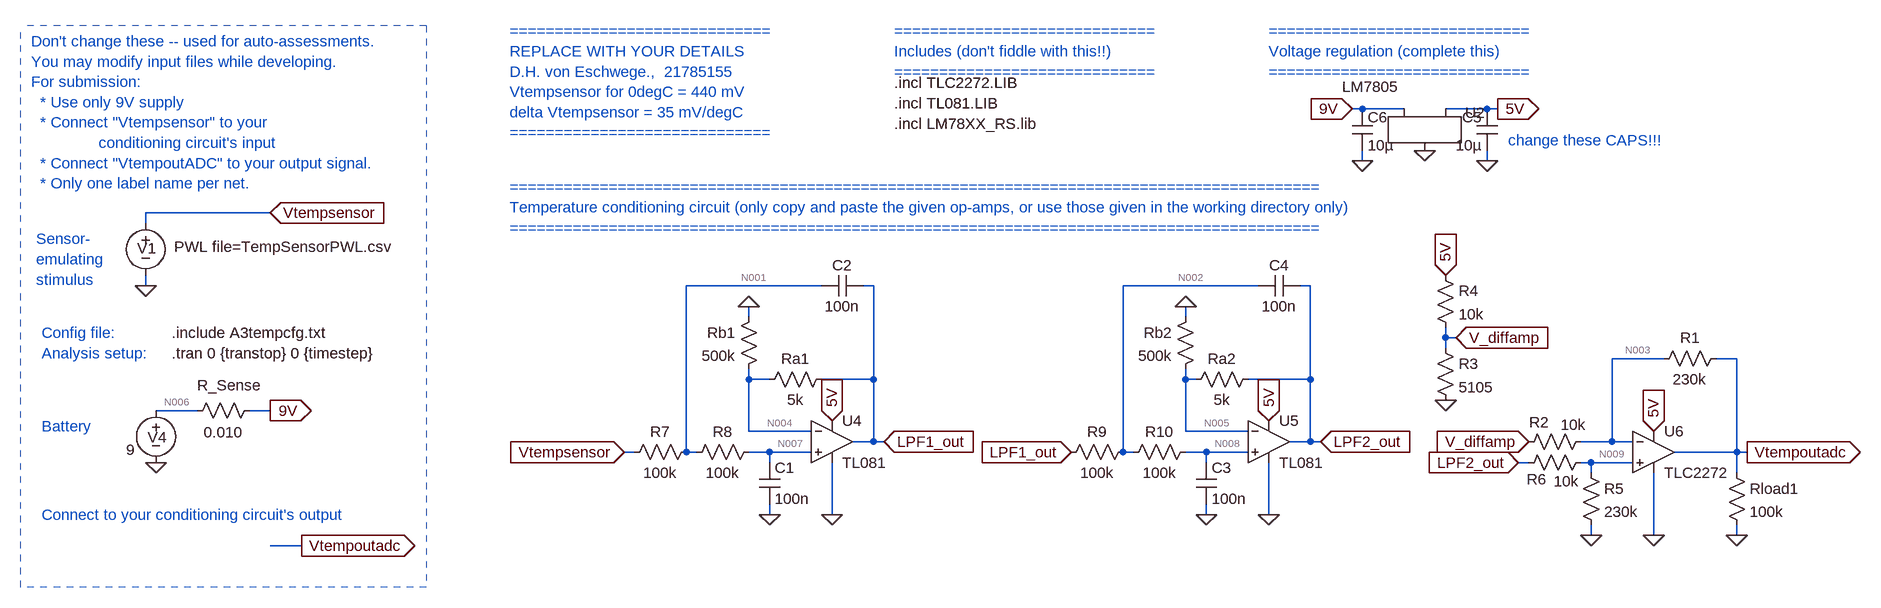
[diagram p0: schematic E344_A3_temp.asc]
E344_A3_temp.asc, the LTspice schematic file:
Version 4
SHEET 1 1824 680
WIRE -240 -1280 -256 -1280
WIRE -176 -1280 -240 -1280
WIRE -48 -1280 -112 -1280
WIRE -32 -1280 -48 -1280
WIRE -240 -1200 -240 -1216
WIRE -48 -1200 -48 -1216
WIRE -1920 -1120 -2112 -1120
WIRE -2112 -1104 -2112 -1120
WIRE -2112 -1008 -2112 -1024
WIRE -1072 -1008 -1280 -1008
WIRE -992 -1008 -1008 -1008
WIRE -400 -1008 -608 -1008
WIRE -320 -1008 -336 -1008
WIRE -1184 -960 -1184 -976
WIRE -512 -960 -512 -976
WIRE -112 -928 -112 -944
WIRE -96 -928 -112 -928
WIRE -112 -912 -112 -928
WIRE 224 -896 144 -896
WIRE 336 -896 304 -896
WIRE -1184 -864 -1184 -880
WIRE -1152 -864 -1184 -864
WIRE -992 -864 -992 -1008
WIRE -992 -864 -1072 -864
WIRE -512 -864 -512 -880
WIRE -496 -864 -512 -864
WIRE -320 -864 -320 -1008
WIRE -320 -864 -416 -864
WIRE -2032 -816 -2096 -816
WIRE -1920 -816 -1952 -816
WIRE -1184 -784 -1184 -864
WIRE -1088 -784 -1184 -784
WIRE -512 -784 -512 -864
WIRE -416 -784 -512 -784
WIRE -992 -768 -992 -864
WIRE -992 -768 -1024 -768
WIRE -976 -768 -992 -768
WIRE -320 -768 -320 -864
WIRE -320 -768 -352 -768
WIRE -304 -768 -320 -768
WIRE 144 -768 144 -896
WIRE 144 -768 96 -768
WIRE 176 -768 144 -768
WIRE -1360 -752 -1376 -752
WIRE -1280 -752 -1280 -1008
WIRE -1264 -752 -1280 -752
WIRE -1152 -752 -1184 -752
WIRE -1088 -752 -1152 -752
WIRE -608 -752 -608 -1008
WIRE -592 -752 -608 -752
WIRE -480 -752 -512 -752
WIRE -416 -752 -480 -752
WIRE 336 -752 336 -896
WIRE 336 -752 240 -752
WIRE 352 -752 336 -752
WIRE -1152 -736 -1152 -752
WIRE -480 -736 -480 -752
WIRE 16 -736 0 -736
WIRE 112 -736 96 -736
WIRE 176 -736 112 -736
WIRE 112 -720 112 -736
WIRE 336 -720 336 -752
WIRE -1152 -656 -1152 -672
WIRE -1056 -656 -1056 -736
WIRE -480 -656 -480 -672
WIRE -384 -656 -384 -736
WIRE 112 -624 112 -640
WIRE 208 -624 208 -720
WIRE 336 -624 336 -640
WIRE -1872 -608 -1920 -608
FLAG -2112 -1008 0
FLAG -1920 -1120 Vtempsensor
IOPIN -1920 -1120 In
FLAG -1920 -816 9V
IOPIN -1920 -816 Out
FLAG -2096 -736 0
FLAG -1872 -608 Vtempoutadc
IOPIN -1872 -608 Out
FLAG 336 -624 0
FLAG 208 -624 0
FLAG -112 -832 0
FLAG 112 -624 0
FLAG -1056 -656 0
FLAG -1152 -656 0
FLAG -1184 -976 0
FLAG -384 -656 0
FLAG -480 -656 0
FLAG -512 -976 0
FLAG -1056 -800 5V
IOPIN -1056 -800 In
FLAG -384 -800 5V
IOPIN -384 -800 In
FLAG -96 -928 V_diffamp
IOPIN -96 -928 In
FLAG 16 -768 V_diffamp
IOPIN 16 -768 In
FLAG -112 -1024 5V
IOPIN -112 -1024 In
FLAG -1376 -752 Vtempsensor
IOPIN -1376 -752 In
FLAG 208 -784 5V
IOPIN 208 -784 In
FLAG 352 -752 Vtempoutadc
IOPIN 352 -752 Out
FLAG -976 -768 LPF1_out
IOPIN -976 -768 In
FLAG -304 -768 LPF2_out
IOPIN -304 -768 In
FLAG 0 -736 LPF2_out
IOPIN 0 -736 In
FLAG -688 -752 LPF1_out
IOPIN -688 -752 In
FLAG -256 -1280 9V
IOPIN -256 -1280 In
FLAG -144 -1216 0
FLAG -32 -1280 5V
IOPIN -32 -1280 Out
FLAG -240 -1200 0
FLAG -48 -1200 0
SYMBOL voltage -2112 -1120 R0
WINDOW 123 0 0 Left 0
WINDOW 39 0 0 Left 0
WINDOW 3 44 52 Left 2
WINDOW 0 -13 54 Left 2
SYMATTR Value PWL file=TempSensorPWL.csv
SYMATTR InstName V1
SYMBOL voltage -2096 -832 R0
WINDOW 123 24 44 Left 2
WINDOW 39 0 0 Left 0
WINDOW 3 -46 76 Left 2
WINDOW 0 -13 57 Left 2
SYMATTR Value 9
SYMATTR InstName V4
SYMBOL res -1936 -832 R90
WINDOW 0 -7 47 VBottom 2
WINDOW 3 34 56 VTop 2
SYMATTR InstName R_Sense
SYMATTR Value 0.010
SYMBOL res 320 -736 R0
SYMATTR InstName Rload1
SYMATTR Value 100k
SYMBOL res 320 -912 R90
WINDOW 0 0 56 VBottom 2
WINDOW 3 32 56 VTop 2
SYMATTR InstName R1
SYMATTR Value 230k
SYMBOL res 112 -784 R90
WINDOW 0 2 80 VBottom 2
WINDOW 3 -26 27 VTop 2
SYMATTR InstName R2
SYMATTR Value 10k
SYMBOL res -128 -928 R0
SYMATTR InstName R3
SYMATTR Value 5105
SYMBOL res -128 -1040 R0
SYMATTR InstName R4
SYMATTR Value 10k
SYMBOL res 96 -736 R0
SYMATTR InstName R5
SYMATTR Value 230k
SYMBOL res 112 -752 R90
WINDOW 0 57 84 VBottom 2
WINDOW 3 29 38 VTop 2
SYMATTR InstName R6
SYMATTR Value 10k
SYMBOL res -1264 -768 R90
WINDOW 0 0 56 VBottom 2
WINDOW 3 32 56 VTop 2
SYMATTR InstName R7
SYMATTR Value 100k
SYMBOL cap -1168 -736 R0
SYMATTR InstName C1
SYMATTR Value 100n
SYMBOL res -1168 -768 R90
WINDOW 0 0 56 VBottom 2
WINDOW 3 32 56 VTop 2
SYMATTR InstName R8
SYMATTR Value 100k
SYMBOL res -1056 -880 R90
WINDOW 0 0 56 VBottom 2
WINDOW 3 32 56 VTop 2
SYMATTR InstName Ra1
SYMATTR Value 5k
SYMBOL res -1168 -976 M0
SYMATTR InstName Rb1
SYMATTR Value 500k
SYMBOL cap -1008 -1024 R90
WINDOW 0 0 32 VBottom 2
WINDOW 3 32 32 VTop 2
SYMATTR InstName C2
SYMATTR Value 100n
SYMBOL res -592 -768 R90
WINDOW 0 0 56 VBottom 2
WINDOW 3 32 56 VTop 2
SYMATTR InstName R9
SYMATTR Value 100k
SYMBOL cap -496 -736 R0
SYMATTR InstName C3
SYMATTR Value 100n
SYMBOL res -496 -768 R90
WINDOW 0 0 56 VBottom 2
WINDOW 3 32 56 VTop 2
SYMATTR InstName R10
SYMATTR Value 100k
SYMBOL res -400 -880 R90
WINDOW 0 0 56 VBottom 2
WINDOW 3 32 56 VTop 2
SYMATTR InstName Ra2
SYMATTR Value 5k
SYMBOL res -496 -976 M0
SYMATTR InstName Rb2
SYMATTR Value 500k
SYMBOL cap -336 -1024 R90
WINDOW 0 0 32 VBottom 2
WINDOW 3 32 32 VTop 2
SYMATTR InstName C4
SYMATTR Value 100n
SYMBOL opamp2 -1056 -832 R0
SYMATTR InstName U4
SYMATTR Value TL081
SYMATTR SpiceModel TL081
SYMBOL opamp2 -384 -832 R0
SYMATTR InstName U5
SYMATTR Value TL081
SYMATTR SpiceModel TL081
SYMBOL opamp2 208 -816 R0
SYMATTR InstName U6
SYMATTR Value TLC2272
SYMATTR SpiceModel TLC2272
SYMBOL LM7805 -144 -1264 R0
WINDOW 3 -83 -66 Top 2
SYMATTR InstName U2
SYMBOL cap -32 -1280 M0
WINDOW 0 24 13 Left 2
SYMATTR InstName C5
SYMATTR Value 10µ
SYMBOL cap -256 -1280 R0
WINDOW 0 24 13 Left 2
SYMATTR InstName C6
SYMATTR Value 10µ
TEXT -2072 -904 Left 2 !.tran 0 {transtop} 0 {timestep}
TEXT -2072 -936 Left 2 !.include A3tempcfg.txt
TEXT -2288 -1384 Left 2 ;Don't change these -- used for auto-assessments.\nYou may modify input files while developing.\nFor submission: \n  * Use only 9V supply \n  * Connect "Vtempsensor" to your \n               conditioning circuit's input\n  * Connect "VtempoutADC" to your output signal.\n  * Only one label name per net.
TEXT -2272 -936 Left 2 ;Config file:
TEXT -2272 -904 Left 2 ;Analysis setup:
TEXT -2272 -792 Left 2 ;Battery
TEXT -2280 -1080 Left 2 ;Sensor-\nemulating \nstimulus
TEXT -1552 -1400 Left 2 ;=============================\nREPLACE WITH YOUR DETAILS\nD.H. von Eschwege.,  21785155\nVtempsensor for 0degC = 440 mV\ndelta Vtempsensor = 35 mV/degC\n=============================
TEXT -1552 -1160 Left 2 ;==========================================================================================\nTemperature conditioning circuit (only copy and paste the given op-amps, or use those given in the working directory only)\n==========================================================================================
TEXT -384 -1400 Left 2 ;=============================\nVoltage regulation (complete this)\n=============================
TEXT -960 -1320 Left 2 !.incl TLC2272.LIB\n.incl TL081.LIB\n.incl LM78XX_RS.lib
TEXT -2272 -656 Left 2 ;Connect to your conditioning circuit's output
TEXT -960 -1400 Left 2 ;=============================\nIncludes (don't fiddle with this!!)\n=============================
TEXT -16 -1232 Left 2 ;change these CAPS!!!
LINE Normal -2304 -544 -2304 -1408 1
LINE Normal -1680 -1408 -1680 -544 1
LINE Normal -1680 -544 -2304 -544 1
LINE Normal -1680 -1408 -2304 -1408 1

The netlist it stands for:
* E344_A3_temp.asc
V1 Vtempsensor 0 PWL file=TempSensorPWL.csv
V4 N006 0 9
R_Sense 9V N006 0.010
Rload1 Vtempoutadc 0 100k
R1 Vtempoutadc N003 230k
R2 N003 V_diffamp 10k
R3 V_diffamp 0 5105
R4 5V V_diffamp 10k
R5 N009 0 230k
R6 N009 LPF2_out 10k
R7 N001 Vtempsensor 100k
C1 N007 0 100n
R8 N007 N001 100k
Ra1 LPF1_out N004 5k
Rb1 0 N004 500k
C2 LPF1_out N001 100n
R9 N002 LPF1_out 100k
C3 N008 0 100n
R10 N008 N002 100k
Ra2 LPF2_out N005 5k
Rb2 0 N005 500k
C4 LPF2_out N002 100n
XU4 N007 N004 5V 0 LPF1_out TL081 TL081  ; pins In+ In- V+ V- OUT
XU5 N008 N005 5V 0 LPF2_out TL081 TL081  ; pins In+ In- V+ V- OUT
XU6 N009 N003 5V 0 Vtempoutadc TLC2272 TLC2272  ; pins In+ In- V+ V- OUT
XU2 9V 0 5V LM7805
C5 5V 0 10µ
C6 9V 0 10µ
.tran 0 {transtop} 0 {timestep}
.include A3tempcfg.txt
* Don't change these -- used for auto-assessments.
* You may modify input files while developing.
* For submission:
*   * Use only 9V supply
*   * Connect "Vtempsensor" to your
*                conditioning circuit's input
*   * Connect "VtempoutADC" to your output signal.
*   * Only one label name per net.
* Config file:
* Analysis setup:
* Battery
* Sensor-
* emulating
* stimulus
* =============================
* REPLACE WITH YOUR DETAILS
* D.H. von Eschwege.,  21785155
* Vtempsensor for 0degC = 440 mV
* delta Vtempsensor = 35 mV/degC
* =============================
* ==========================================================================================
* Temperature conditioning circuit (only copy and paste the given op-amps, or use those given in the working directory only)
* ==========================================================================================
* =============================
* Voltage regulation (complete this)
* =============================
.incl TLC2272.LIB
.incl TL081.LIB
.incl LM78XX_RS.lib
* Connect to your conditioning circuit's output
* =============================
* Includes (don't fiddle with this!!)
* =============================
* change these CAPS!!!
.backanno
.end

* Results of the author's LTspice run, read from the files saved beside the schematic
* Operating Point, zero values left out:
*   V(vtempsensor) = 1.91 V
*   V(n006) = 9 V
*   V(9v) = 9 V
*   V(vtempoutadc) = 4.907 V
*   V(n003) = 1.868 V
*   V(v_diffamp) = 1.735 V
*   V(5v) = 5.003 V
*   V(n009) = 1.867 V
*   V(lpf2_out) = 1.948 V
*   V(n001) = 1.91 V
*   V(n007) = 1.91 V
*   V(lpf1_out) = 1.929 V
*   V(n004) = 1.91 V
*   V(n002) = 1.929 V
*   V(n008) = 1.929 V
*   V(n005) = 1.929 V
*   I(Rb2) = -3.858 µA
*   I(Ra2) = 3.858 µA
*   I(R10) = -31.98 pA
*   I(R9) = -31.98 pA
*   I(Rb1) = -3.82 µA
*   I(Ra1) = 3.82 µA
*   I(R8) = -31.96 pA
*   I(R7) = -31.96 pA
*   I(R6) = -8.118 µA
*   I(R5) = 8.118 µA
*   I(R4) = 326.7 µA
*   I(R3) = 340 µA
*   I(R2) = 13.21 µA
*   I(R1) = 13.21 µA
*   I(Rload1) = 49.07 µA
*   I(R_sense) = -12.87 mA
*   I(V4) = -12.87 mA
*   I(V1) = -31.96 pA